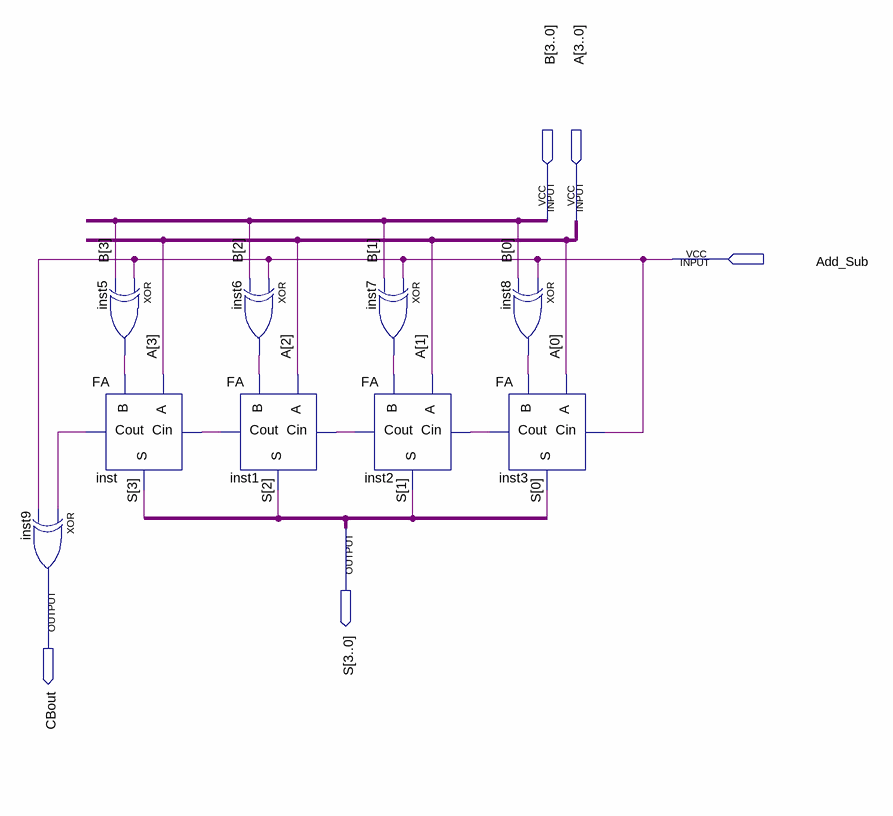
[diagram p0: schematic sheet]
// Quartus schematic 4bitAddSub.bdf as structural Verilog: 9 symbols, 5 pins
module \4bitAddSub  (
  input  [3:0] B,
  input  [3:0] A,
  input  Add_Sub,
  output [3:0] S,
  output CBout
);

  wire inst1_cout, inst2_cout, inst3_cout, inst5_out, inst6_out, inst7_out, inst8_out, inst_cout;

  xor inst9 (CBout, inst_cout, Add_Sub);
  xor inst5 (inst5_out, Add_Sub, B[3]);
  FA inst (.A(A[3]), .B(inst5_out), .Cin(inst1_cout), .S(S[3]), .Cout(inst_cout));
  xor inst6 (inst6_out, Add_Sub, B[2]);
  FA inst1 (.A(A[2]), .B(inst6_out), .Cin(inst2_cout), .S(S[2]), .Cout(inst1_cout));
  xor inst7 (inst7_out, Add_Sub, B[1]);
  FA inst2 (.A(A[1]), .B(inst7_out), .Cin(inst3_cout), .S(S[1]), .Cout(inst2_cout));
  FA inst3 (.A(A[0]), .B(inst8_out), .Cin(Add_Sub), .S(S[0]), .Cout(inst3_cout));
  xor inst8 (inst8_out, Add_Sub, B[0]);
endmodule
